# Altium schematic sheet MarsCarrier_PWR.SchDoc: My title
size A3; Organization: University of California; Address1: 475 Portola Plaza; Address2: Los Angeles, CA 90095; DocumentNumber: 13; Revision: R01; SheetNumber: 13; SheetTotal: 35
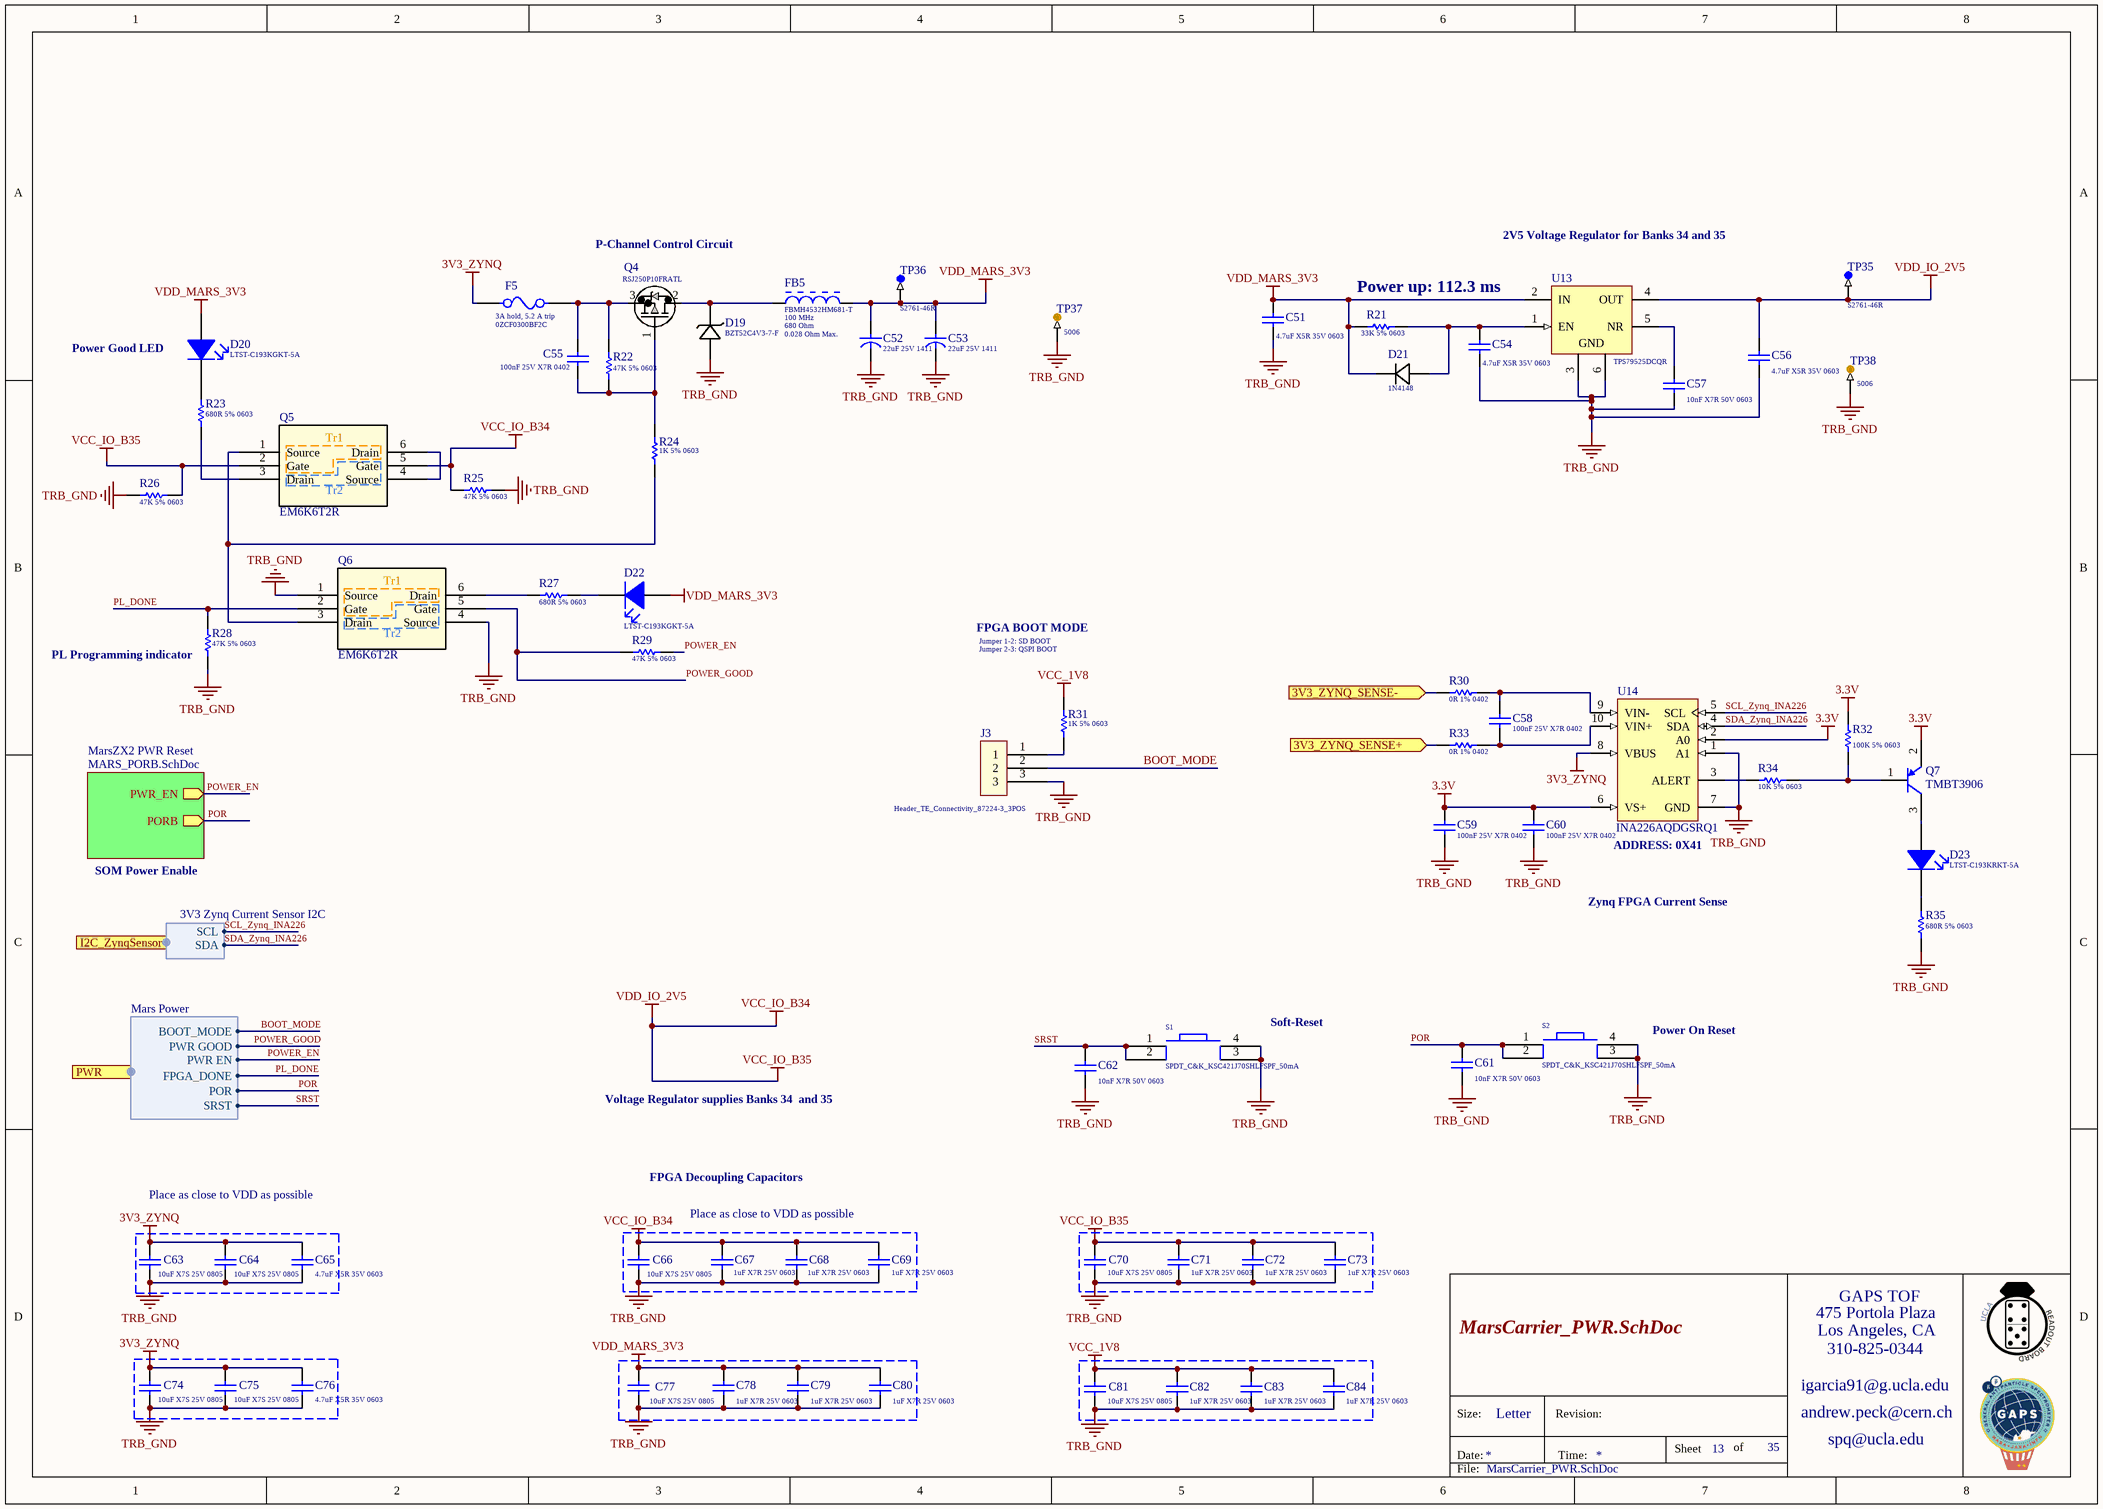
[diagram p0: MarsCarrier_PWR.SchDoc]

## Parts
C51  Capacitance: 4.7uF X5R 35V 0603  [Cap_Murata_ZRB18AR6YA475ME05L_4.7uF]  (hidden comment: Cap_Murata_ZRB18AR6YA475ME05L_4.7uF)
C52  Capacitance: 22uF 25V 1411  [Cap_Kemet_T521B226M025ATE100_22uF]  (hidden comment: Cap_Kemet_T521B226M025ATE100_22uF)
C53  Capacitance: 22uF 25V 1411  [Cap_Kemet_T521B226M025ATE100_22uF]  (hidden comment: Cap_Kemet_T521B226M025ATE100_22uF)
C54  Capacitance: 4.7uF X5R 35V 0603  [Cap_Murata_ZRB18AR6YA475ME05L_4.7uF]  (hidden comment: Cap_Murata_ZRB18AR6YA475ME05L_4.7uF)
C55  Capacitance: 100nF 25V X7R 0402  [Cap_Taiyo_Yuden_TMK105B7104KV-FR_100nF]  (hidden comment: Cap_Taiyo_Yuden_TMK105B7104KV-FR_100nF)
C56  Capacitance: 4.7uF X5R 35V 0603  [Cap_Murata_ZRB18AR6YA475ME05L_4.7uF]  (hidden comment: Cap_Murata_ZRB18AR6YA475ME05L_4.7uF)
C57  Capacitance: 10nF X7R 50V 0603  [Kemet_C0603_0]  (hidden comment: Cap_Kemet_C0603C103J5RACTU_eec)
C58  Capacitance: 100nF 25V X7R 0402  [Cap_Taiyo_Yuden_TMK105B7104KV-FR_100nF]  (hidden comment: Cap_Taiyo_Yuden_TMK105B7104KV-FR_100nF)
C59  Capacitance: 100nF 25V X7R 0402  [Cap_Taiyo_Yuden_TMK105B7104KV-FR_100nF]  (hidden comment: Cap_Taiyo_Yuden_TMK105B7104KV-FR_100nF)
C60  Capacitance: 100nF 25V X7R 0402  [Cap_Taiyo_Yuden_TMK105B7104KV-FR_100nF]  (hidden comment: Cap_Taiyo_Yuden_TMK105B7104KV-FR_100nF)
C61  Capacitance: 10nF X7R 50V 0603  [Kemet_C0603_0]  (hidden comment: Cap_Kemet_C0603C103J5RACTU_eec)
C62  Capacitance: 10nF X7R 50V 0603  [Kemet_C0603_0]  (hidden comment: Cap_Kemet_C0603C103J5RACTU_eec)
C63  Capacitance: 10uF X7S 25V 0805  [Cap_Murata_ GRM21BC71E106ME11L_10uF]  (hidden comment: Cap_Murata_ GRM21BC71E106ME11L_10uF)
C64  Capacitance: 10uF X7S 25V 0805  [Cap_Murata_ GRM21BC71E106ME11L_10uF]  (hidden comment: Cap_Murata_ GRM21BC71E106ME11L_10uF)
C65  Capacitance: 4.7uF X5R 35V 0603  [Cap_Murata_ZRB18AR6YA475ME05L_4.7uF]  (hidden comment: Cap_Murata_ZRB18AR6YA475ME05L_4.7uF)
C66  Capacitance: 10uF X7S 25V 0805  [Cap_Murata_ GRM21BC71E106ME11L_10uF]  (hidden comment: Cap_Murata_ GRM21BC71E106ME11L_10uF)
C67  Capacitance: 1uF X7R 25V 0603  [Cap_Murata_GCJ188R71E105KA01J_1uF]  (hidden comment: Cap_Murata_GCJ188R71E105KA01J_1uF)
C68  Capacitance: 1uF X7R 25V 0603  [Cap_Murata_GCJ188R71E105KA01J_1uF]  (hidden comment: Cap_Murata_GCJ188R71E105KA01J_1uF)
C69  Capacitance: 1uF X7R 25V 0603  [Cap_Murata_GCJ188R71E105KA01J_1uF]  (hidden comment: Cap_Murata_GCJ188R71E105KA01J_1uF)
C70  Capacitance: 10uF X7S 25V 0805  [Cap_Murata_ GRM21BC71E106ME11L_10uF]  (hidden comment: Cap_Murata_ GRM21BC71E106ME11L_10uF)
C71  Capacitance: 1uF X7R 25V 0603  [Cap_Murata_GCJ188R71E105KA01J_1uF]  (hidden comment: Cap_Murata_GCJ188R71E105KA01J_1uF)
C72  Capacitance: 1uF X7R 25V 0603  [Cap_Murata_GCJ188R71E105KA01J_1uF]  (hidden comment: Cap_Murata_GCJ188R71E105KA01J_1uF)
C73  Capacitance: 1uF X7R 25V 0603  [Cap_Murata_GCJ188R71E105KA01J_1uF]  (hidden comment: Cap_Murata_GCJ188R71E105KA01J_1uF)
C74  Capacitance: 10uF X7S 25V 0805  [Cap_Murata_ GRM21BC71E106ME11L_10uF]  (hidden comment: Cap_Murata_ GRM21BC71E106ME11L_10uF)
C75  Capacitance: 10uF X7S 25V 0805  [Cap_Murata_ GRM21BC71E106ME11L_10uF]  (hidden comment: Cap_Murata_ GRM21BC71E106ME11L_10uF)
C76  Capacitance: 4.7uF X5R 35V 0603  [Cap_Murata_ZRB18AR6YA475ME05L_4.7uF]  (hidden comment: Cap_Murata_ZRB18AR6YA475ME05L_4.7uF)
C77  Capacitance: 10uF X7S 25V 0805  [Cap_Murata_ GRM21BC71E106ME11L_10uF]  (hidden comment: Cap_Murata_ GRM21BC71E106ME11L_10uF)
C78  Capacitance: 1uF X7R 25V 0603  [Cap_Murata_GCJ188R71E105KA01J_1uF]  (hidden comment: Cap_Murata_GCJ188R71E105KA01J_1uF)
C79  Capacitance: 1uF X7R 25V 0603  [Cap_Murata_GCJ188R71E105KA01J_1uF]  (hidden comment: Cap_Murata_GCJ188R71E105KA01J_1uF)
C80  Capacitance: 1uF X7R 25V 0603  [Cap_Murata_GCJ188R71E105KA01J_1uF]  (hidden comment: Cap_Murata_GCJ188R71E105KA01J_1uF)
C81  Capacitance: 10uF X7S 25V 0805  [Cap_Murata_ GRM21BC71E106ME11L_10uF]  (hidden comment: Cap_Murata_ GRM21BC71E106ME11L_10uF)
C82  Capacitance: 1uF X7R 25V 0603  [Cap_Murata_GCJ188R71E105KA01J_1uF]  (hidden comment: Cap_Murata_GCJ188R71E105KA01J_1uF)
C83  Capacitance: 1uF X7R 25V 0603  [Cap_Murata_GCJ188R71E105KA01J_1uF]  (hidden comment: Cap_Murata_GCJ188R71E105KA01J_1uF)
C84  Capacitance: 1uF X7R 25V 0603  [Cap_Murata_GCJ188R71E105KA01J_1uF]  (hidden comment: Cap_Murata_GCJ188R71E105KA01J_1uF)
D19  BZT52C4V3-7-F  [SOD123]
D20  Series: LTST-C193KGKT-5A  [Led_Lite-On_LTST-C193KGKT-5A_Green]  (hidden comment: Led_Lite-On_LTST-C193KGKT-5A_Green)
D21  Series: 1N4148  [Diode_ON_Semiconductor_1N4148WT_300mA]  (hidden comment: Diode_ON_Semiconductor_1N4148WT_300mA)
D22  Series: LTST-C193KGKT-5A  [Led_Lite-On_LTST-C193KGKT-5A_Green]  (hidden comment: Led_Lite-On_LTST-C193KGKT-5A_Green)
D23  LTST-C193KRKT-5A  [Led_Lite-On_LTST-C193KGKT-5A_Red]
F5  3A hold, 5.2 A trip  [Bel_0ZCF_MFG]
FB5  Measuring Frequency: 100 MHz  Nominal Impedance: 680 Ohm  DC Resistance: 0.028 Ohm Max.  [TAYO-FBMH4532-2_V]  (hidden comment: FBMH4532HM681-T)
J3  Header_TE_Connectivity_87224-3_3POS  [Header_TE_Connectivity_87224-3_3POS]
Q4  Series: RSJ250P10FRATL  [Mos_ROHM_RSJ250P10FRATL_25A]  (hidden comment: Mos_ROHM_RSJ250P10FRATL_25A)
Q5  EM6K6T2R  [TRANS_EM6_ROM]
Q6  EM6K6T2R  [TRANS_EM6_ROM]
Q7  Series: TMBT3906  [BJT_PNP_Toshiba_TMBT3906]  (hidden comment: BJT_PNP_Toshiba_TMBT3906)
R21  33K 5% 0603  [RESC0603(1608)_L]
R22  47K 5% 0603  [RESC0603(1608)_L]
R23  680R 5% 0603  [RESC0603(1608)_L]
R24  1K 5% 0603  [RESC0603(1608)_L]
R25  47K 5% 0603  [RESC0603(1608)_L]
R26  47K 5% 0603  [RESC0603(1608)_L]
R27  680R 5% 0603  [RESC0603(1608)_L]
R28  47K 5% 0603  [RESC0603(1608)_L]
R29  47K 5% 0603  [RESC0603(1608)_L]
R30  Resistance: 0R 1% 0402  [Res_Vishay_CRCW04020000Z0EDC_0_Ohm]  (hidden comment: Res_Vishay_CRCW04020000Z0EDC_0_Ohm)
R31  1K 5% 0603  [RESC0603(1608)_L]
R32  100K 5% 0603  [RESC0603(1608)_N]
R33  Resistance: 0R 1% 0402  [Res_Vishay_CRCW04020000Z0EDC_0_Ohm]  (hidden comment: Res_Vishay_CRCW04020000Z0EDC_0_Ohm)
R34  10K 5% 0603  [RESC0603(1608)_L]
R35  680R 5% 0603  [RESC0603(1608)_L]
S1  SPDT_C&K_KSC421J70SHLFSPF_50mA  [SPDT_C&K_KSC421J70SHLFSPF_50mA]
S2  SPDT_C&K_KSC421J70SHLFSPF_50mA  [SPDT_C&K_KSC421J70SHLFSPF_50mA]
TP35  Series: S2761-46R  [TP_Harwin_S2761_46R]  (hidden comment: TP_Harwin_S2761_46R)
TP36  Series: S2761-46R  [TP_Harwin_S2761_46R]  (hidden comment: TP_Harwin_S2761_46R)
TP37  Series: 5006  [TP_Keystone_Electronics_5006]  (hidden comment: TP_Keystone_Electronics_5006)
TP38  Series: 5006  [TP_Keystone_Electronics_5006]  (hidden comment: TP_Keystone_Electronics_5006)
U13  TPS79525DCQR  [DCQ0006A_L]
U14  INA226AQDGSRQ1  [INA226AQDGSRQ1]

## Blocks framed on the sheet
Place as close to VDD as possible: C66-C69

## Sub-sheets
MarsZX2 PWR Reset = MARS_PORB.SchDoc: PWR_EN (out), PORB (out)

## Ports
3V3_ZYNQ_SENSE+ (in), 3V3_ZYNQ_SENSE- (in), I2C_ZynqSensor (harness 3V3 Zynq Current Sensor I2C), PWR (harness Mars Power)

## Harnesses
Mars Power: PWR GOOD, PWR EN, FPGA_DONE, SRST, POR, BOOT_MODE
3V3 Zynq Current Sensor I2C: SCL, SDA

## Nets
3.3V: C59.2 C60.2 Q7.2(E) R32.2 U14.2(A0) U14.6(VS+)
3V3_ZYNQ: C63.1 C64.1 C65.1 C74.1 C75.1 C76.1 F5.1 U14.8(VBUS)
TRB_GND: C51.1 C52.2 C53.2 C54.1 C56.1 C57.2 C59.1 C60.1 C61.2 C62.2 C63.2 C64.2 C65.2 C66.2 C67.1 C68.1 C69.1 C70.2 C71.1 C72.1 C73.1 C74.2 C75.2 C76.2 C77.2 C78.1 C79.1 C80.1 C81.2 C82.1 C83.1 C84.1 D19.2 J3.3 Q6.1(Source) Q6.4(Source) R25.2 R26.2 R28.1 R35.1 S1.3 S1.4 S2.3 S2.4 TP37.1 TP38.1 U13.3(GND) U13.6(GND) U14.1(A1) U14.7(GND)
VCC_1V8: C81.1 C82.2 C83.2 C84.2 R31.2
VCC_IO_B34: C56.2 C66.1 C67.2 C68.2 C69.2 C70.1 C71.2 C72.2 C73.2 Q5.2(Gate) Q5.5(Gate) R25.1 R26.1 TP35.1 U13.4(OUT)  [also labelled VCC_IO_B35, VDD_IO_2V5]
VDD_MARS_3V3: C51.2 C52.1 C53.1 C77.1 C78.2 C79.2 C80.2 D20.2(A) D21.1 D22.2(A) FB5.2 R21.1 TP36.1 U13.2(IN)
3V3_ZYNQ_SENSE+: R33.1 ; port 3V3_ZYNQ_SENSE+
3V3_ZYNQ_SENSE-: R30.1 ; port 3V3_ZYNQ_SENSE-
BOOT_MODE: J3.2 ; port PWR.BOOT_MODE
PL_DONE: Q6.2(Gate) R28.2 ; port PWR.FPGA_DONE
POR: C61.1 S2.1 S2.2 ; sheet MarsZX2 PWR Reset/PORB, port PWR.POR
POWER_EN: R29.1 ; sheet MarsZX2 PWR Reset/PWR_EN, port PWR.PWR EN
POWER_GOOD: Q6.5(Gate) R29.2 ; port PWR.PWR GOOD
SCL_Zynq_INA226: U14.5(SCL) ; port I2C_ZynqSensor.SCL
SDA_Zynq_INA226: U14.4(SDA) ; port I2C_ZynqSensor.SDA
SRST: C62.1 S1.1 S1.2 ; port PWR.SRST
NetC54_2: C54.2 D21.2 R21.2 U13.1(EN)
NetC55_1: C55.1 Q4.1(G) R22.1 R24.2
NetC55_2: C55.2 F5.2 Q4.3(S) R22.2
NetC57_1: C57.1 U13.5(NR)
NetC58_1: C58.1 R33.2 U14.10(VIN+)
NetC58_2: C58.2 R30.2 U14.9(VIN-)
NetD19_1: D19.1 FB5.1 Q4.2(D)
NetD20_1: D20.1(K) R23.2
NetD22_1: D22.1(K) R27.1
NetD23_1: D23.1(K) R35.2
NetD23_2: D23.2(A) Q7.3(C)
NetJ3_1: J3.1 R31.1
NetQ5_1: Q5.1(Source) Q6.3(Drain) R24.1
NetQ5_3: Q5.3(Drain) R23.1
NetQ5_4: Q5.4(Source) Q5.6(Drain)
NetQ6_6: Q6.6(Drain) R27.2
NetQ7_1: Q7.1(B) R32.1 R34.1
NetR34_2: R34.2 U14.3(ALERT)

## Notes on the sheet
- P-Channel Control Circuit
- 2V5 Voltage Regulator for Banks 34 and 35
- Power up: 112.3 ms
- Power Good LED
- FPGA BOOT MODE
- Jumper 1-2: SD BOOT
- Jumper 2-3: QSPI BOOT
- (near R28) PL Programming indicator
- (near U14) ADDRESS: 0X41
- SOM Power Enable
- Zynq FPGA Current Sense
- (near S1) Soft-Reset
- Power On Reset
- Voltage Regulator supplies Banks 34  and 35
- FPGA Decoupling Capacitors
- Place as close to VDD as possible
- 475 Portola Plaza
- GAPS TOF
- igarcia91@g.ucla.edu
- Los Angeles, CA
- 310-825-0344
- Size:
- Date:
- Letter
- Revision:
- Time:
- Sheet
- of
- andrew.peck@cern.ch
- spq@ucla.edu
- File:
- (in symbol EM6K6T2R) Tr1; Tr2

## Library data of the parts
C51 C54 C56 C65 C76 = Cap_Murata_ZRB18AR6YA475ME05L_4.7uF: CAP CER 4.7uF 35V X5R 0603; Supplier 1: Mouser; Supplier Part Number 1: 81-ZRB18AR6YA475ME5L
C52 C53 = Cap_Kemet_T521B226M025ATE100_22uF: Tantalum Capacitors - Polymer SMD 25V 22uF 1311 20% ESR=100mOhms; Supplier 1: Mouser; Supplier Part Number 1: 80-T521B226M25ATE100
C55 C58-C60 = Cap_Taiyo_Yuden_TMK105B7104KV-FR_100nF: CAP CER 100nF 25V X7R 0402; Supplier 1: Mouser; Supplier Part Number 1: 963-TMK105B7104KV-FR
C57 C61 C62 = Cap_Kemet_C0603C103J5RACTU_eec: CAP CER 10nF 50V X7R 0603; Manufacturer: Kemet; Mfg Package Ident: C0603; Part Number: C0603C103J5RACTU; helpURL: https://upverter.com/upn/revision/8a8d0c297e33ac74/; ComponentLink2Description: Datasheet; Temperature: -55°C to +125°C; Package: C0603; Supplier 2: Mouser; Price: 0.0184203126773; Supplier 1: Digi-Key; ComponentLink1URL: https://upverter.com/upn/revision/8a8d0c297e33ac74/; Supplier Part Number 2: 80-C0603C103J5R; Supplier Part Number 1: 399-1092-1-ND; Value: 10nF; ComponentLink1Description: Upverter; ComponentLink2URL: https://content.kemet.com/datasheets/KEM_C1002_X7R_SMD.pdf; RoHS: TRUE; Mouser Part Number: 80-C0603C103J5R; Temperature Range High: +125°C; Digikey Description: CAP CER 10000PF 50V X7R 0603; Digikey Part Number: 399-1092-1-ND; Lead Free: yes; Temperature Range Low: -55°C; Voltage: 50V
C63 C64 C66 C70 C74 C75 C77 C81 = Cap_Murata_ GRM21BC71E106ME11L_10uF: CAP CER 10uF 25V X7R 0805; Supplier 1: Mouser; Supplier Part Number 1: 81-GRM21BC71E106ME1L
C67-C69 C71-C73 C78-C80 C82-C84 = Cap_Murata_GCJ188R71E105KA01J_1uF: CAP CER 1uF 25V X7R 0603; Supplier 1: Mouser; Supplier Part Number 1: 81-GCJ188R71E105KA1J
D19 = BZT52C4V3-7-F: Zener Diodes 500mW 4.3V Zener AEC-Q101 Qualified; Vendor: Diodes Inc; Built_By: EMA_UL_Team; Type: DEV; C: Copyright (C) 2015 Accelerated Designs. All rights reserved; Manufacturer_Part_Number: BZT52C4V3-7-F; RefDes: RefDes; Supplier 1: Mouser; Supplier Part Number 1: 621-BZT52C4V3-F; Series: BZT52C4V3-7-F
D20 D22 = Led_Lite-On_LTST-C193KGKT-5A_Green: Standard LEDs - SMD Green 470nm 28mcd 20mA; Supplier 1: Mouser; Supplier Part Number 1: 859-LTSTC193KGKT5A
D21 = Diode_ON_Semiconductor_1N4148WT_300mA: Diodes - General Purpose, Power, Switching SINGLE JUNC. 75V 4.0NS COMP; Supplier 1: Mouser; Supplier Part Number 1: 512-1N4148WT
D23 = Led_Lite-On_LTST-C193KGKT-5A_Red: Standard LEDs - SMD Red 470nm 28mcd 20mA; Supplier 1: Mouser; Supplier Part Number 1: 859-LTSTC193KRKT5A; Series: LTST-C193KRKT-5A
F5 = 0ZCF0300BF2C: Resettable Fuses - PPTC 3A 24V PPTC 2920 SMD; Supplier 1: Mouser; Supplier 2: Digi-Key; Supplier Part Number 1: 530-0ZCF0300BF2C; Supplier Part Number 2: 507-2072-6-ND; Series: 0ZCF0300BF2C
FB5 = FBMH4532HM681-T: Chip Bead Inductor for Power Lines, 680 Ohm, 4 A, -40 to 125 degC, 2-Pin 4.5 x 3.2 x 3.5 mm SMD, RoHS, Taping; Manufacturer: Taiyo Yuden; Rated Current: 4 A Max.; Impedance Tolerance: +/- 25%; ComponentLink1Description: Manufacturer URL; ComponentLink2Description: Datasheet; DatasheetVersion: 09/2014; ComponentLink3URL: http://www.yuden.co.jp/productdata/catalog/en/chipbeads01_e.pdf; ComponentLink3Description: Package Specification; ComponentLink1URL: http://www.t-yuden.com/; Mounting Technology: Surface Mount; Packing: Taping; Temperature Range: -40 to 125 degC; PartNumber: FBMH4532HM681-T; PackageDescription: 2-Pin Surface Mount Device, Body 4.5 x 3.2 mm, Height 3.5 mm; ComponentLink2URL: http://www.yuden.co.jp/productdata/catalog/en/chipbeads01_e.pdf; RoHS: TRUE; Supplier 1: Digi-Key; Supplier Part Number 1: 587-1761-6-ND
J3 = Header_TE_Connectivity_87224-3_3POS: Headers & Wire Housings UNSHRD VERT SNGL 3; Supplier 1: Mouser; Supplier Part Number 1: 571-872243
Q4 = Mos_ROHM_RSJ250P10FRATL_25A: MOSFET Pch -100V Vds -25A 0.05Rds(on) 60Qg; Supplier Part Number 1: 755-RSJ250P10FRATL; Supplier 1: Mouser
Q5 Q6 = EM6K6T2R: MOSFET Small Signal Dual N-CH 20V .3A .15W; Vendor: ROHM Semiconductor; Manufacturer_Part_Number: EM6K6T2R
Q7 = BJT_PNP_Toshiba_TMBT3906: Bipolar Transistors - BJT Transistor for Low Freq. Amplification; Manufacturer Part Number 1: TMBT3906,LM; Supplier 1: Mouser; Supplier Part Number 1: 757-TMBT3906LM; Manufacturer: Toshiba
R21 = CMP-1012-00110-1: 33K 0.1W 5% 0603 (1608 Metric)  SMD; Value: 33000.00 Ohm; Case-EIA: 0603; Case-Metric: 1608; Tolerance: 5 %; Power: 0.1 W; Technology: SMT
R22 R25 R26 R28 R29 = CMP-1012-00114-1: 47K 0.1W 5% 0603 (1608 Metric)  SMD; Case-EIA: 0603; Value: 47000.00 Ohm; Case-Metric: 1608; Tolerance: 5 %; Power: 0.1 W; Technology: SMT
R23 R27 R35 = CMP-1012-00070-1: 680R 0.1W 5% 0603 (1608 Metric)  SMD; Case-EIA: 0603; Value: 680.00 Ohm; Case-Metric: 1608; Tolerance: 5 %; Technology: SMT; Power: 0.1 W
R24 R31 = CMP-1012-00074-1: 1K 0.1W 5% 0603 (1608 Metric)  SMD; Case-EIA: 0603; Case-Metric: 1608; Value: 1000.00 Ohm; Technology: SMT; Tolerance: 5 %; Power: 0.1 W
R30 R33 = Res_Vishay_CRCW04020000Z0EDC_0_Ohm: 0R 0.062W 1% 0402 (1005 Metric)  SMD; Supplier 1: Mouser; Supplier Part Number 1: 71-CRCW04020000Z0EDC
R32 = CMP-1012-00122-1: 100K 0.1W 5% 0603 (1608 Metric)  SMD; Case-EIA: 0603; Value: 100000.00 Ohm; Case-Metric: 1608; Tolerance: 5 %; Power: 0.1 W; Technology: SMT
R34 = CMP-1012-00098-1: 10K 0.1W 5% 0603 (1608 Metric)  SMD; Case-EIA: 0603; Value: 10000.00 Ohm; Case-Metric: 1608; Technology: SMT; Tolerance: 5 %; Power: 0.1 W
S1 S2 = SPDT_C&K_KSC421J70SHLFSPF_50mA: Tactile Switches Tact 6.2 x 6.2, 5.1 mm H, 1.7N, J leads, Potting Friendly, IP67; Supplier 1: Mouser; Supplier Part Number 1: 611-KSC421J70SHLFSPF
TP35 TP36 = TP_Harwin_S2761_46R: Circuit Board Hardware - PCB SMT Mini Test Terminal, Reel; Supplier 1: Newark; Supplier Part Number 1: 76Y5391
TP37 TP38 = TP_Keystone_Electronics_5006: Circuit Board Hardware - PCB TEST POINT BLK .063; Supplier 1: Mouser; Supplier Part Number 1: 534-5006
U13 = CMP-0395-00444-2: Single Output High PSRR LDO, 500 mA, Fixed 2.5 V Output, 2.7 to 5.5 V Input, 6-pin SOT-223 (DCQ), -40 to 125 degC, Green (RoHS & no Sb/Br); Manufacturer: Texas Instruments; Iout(Max)(A): 0.5; Vout Adj(Min)(V): 2.5; Vin(Max)(V): 5.5; SubFamily: Single Channel LDO; Vdo(Typ)(mV): 110; Rating: Catalog; Accuracy(%): 2; Iq(Typ)(mA): 0.26; Vin(Min)(V): 2.7; ComponentLink3URL: http://www.ti.com/litv/pdf/mpds098c; ComponentLink1URL: http://www.ti.com/; Eco-Plan: Green (RoHS & no Sb/Br); PackageDescription: 6-Pin Plastic Small Outline, Body 3.5 x 6.5 mm, Pitch 1.27 mm; PartNumber: TPS79525DCQR; Fixed Output Options(V): 2.5; ComponentLink1Description: Manufacturer URL; PackageReference: DCQ0006A; ComponentLink2Description: Datasheet; Vout Adj(Max)(V): 2.5; ComponentLink3Description: Package Specification; ComponentLink2URL: http://www.ti.com/general/docs/lit/getliterature.tsp?genericPartNumber=TPS79525&fileType=pdf; Mounting Technology: Surface Mount; DatasheetVersion: SLVS350H; PackageVersion: 4202109/D; Supplier 1: Mouser; Supplier Part Number 1: 595-TPS79525DCQR
U14 = INA226AQDGSRQ1: Current & Power Monitors & Regulators Automotive, 36-V, Ultra-High Accuracy, Low-/High-Side, I2C Out Current/Power Monitor w/ Alert 10-VSSOP -40 to 125; Supplier 1: Mouser; Supplier Part Number 1: 595-INA226AQDGSRQ1